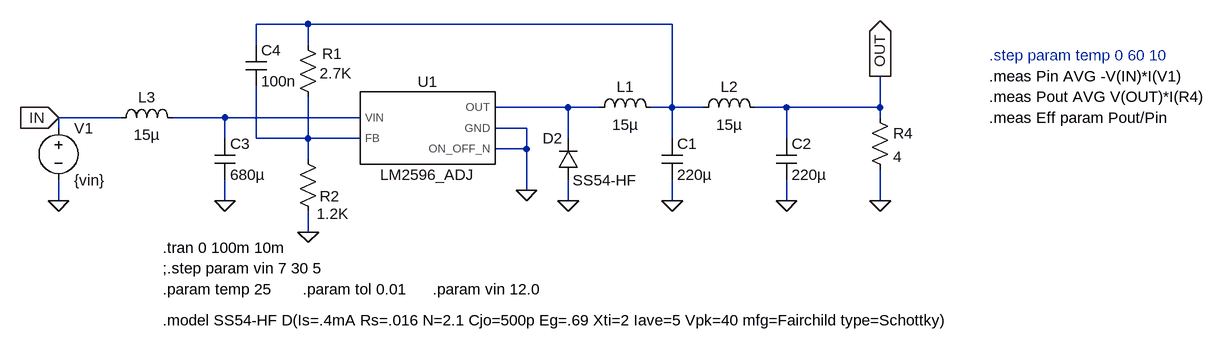
[diagram p0: schematic LM2596 - 4V.asc]
LM2596 - 4V.asc, the LTspice schematic file:
Version 4
SHEET 1 1460 680
WIRE 48 -16 -32 -16
WIRE 608 -16 48 -16
WIRE -32 16 -32 -16
WIRE 48 16 48 -16
WIRE 448 112 336 112
WIRE 496 112 448 112
WIRE 608 112 608 -16
WIRE 608 112 576 112
WIRE 656 112 608 112
WIRE 784 112 736 112
WIRE 928 112 928 64
WIRE 928 112 784 112
WIRE -240 128 -336 128
WIRE -80 128 -160 128
WIRE 128 128 -80 128
WIRE 928 128 928 112
WIRE -336 144 -336 128
WIRE 384 144 336 144
WIRE -80 160 -80 128
WIRE -32 160 -32 80
WIRE 48 160 48 96
WIRE 48 160 -32 160
WIRE 128 160 48 160
WIRE 448 160 448 112
WIRE 608 160 608 112
WIRE 784 160 784 112
WIRE 384 176 384 144
WIRE 384 176 336 176
WIRE 48 192 48 160
WIRE 384 240 384 176
WIRE -336 256 -336 224
WIRE -80 256 -80 224
WIRE 448 256 448 224
WIRE 608 256 608 224
WIRE 784 256 784 224
WIRE 928 256 928 208
WIRE 48 304 48 272
FLAG -336 256 0
FLAG 384 240 0
FLAG 448 256 0
FLAG 608 256 0
FLAG 48 304 0
FLAG 928 256 0
FLAG 928 64 OUT
IOPIN 928 64 Out
FLAG -336 128 IN
IOPIN -336 128 In
FLAG 784 256 0
FLAG -80 256 0
SYMBOL voltage -336 128 R0
WINDOW 123 0 0 Left 0
WINDOW 39 0 0 Left 0
SYMATTR InstName V1
SYMATTR Value {vin}
SYMBOL res 32 0 R0
WINDOW 0 38 30 Left 2
WINDOW 3 34 60 Left 2
SYMATTR InstName R1
SYMATTR Value 2.7K
SYMBOL ind 480 128 R270
WINDOW 0 32 56 VTop 2
WINDOW 3 5 56 VBottom 2
SYMATTR InstName L1
SYMATTR Value 15µ
SYMATTR SpiceLine Rser=0.093
SYMBOL cap 592 160 R0
SYMATTR InstName C1
SYMATTR Value 220µ
SYMBOL res 32 176 R0
WINDOW 0 34 73 Left 2
WINDOW 3 29 100 Left 2
SYMATTR InstName R2
SYMATTR Value 1.2K
SYMBOL res 912 112 R0
SYMATTR InstName R4
SYMATTR Value 4
SYMATTR SpiceLine tol=1
SYMBOL AutoGenerated\\LM2596_ADJ_TRANS 224 144 R0
SYMATTR InstName U1
SYMBOL diode 464 224 R180
WINDOW 0 24 64 Left 2
WINDOW 3 -90 0 Left 2
SYMATTR InstName D2
SYMATTR Value SS54-HF
SYMBOL ind 640 128 R270
WINDOW 0 32 56 VTop 2
WINDOW 3 5 56 VBottom 2
SYMATTR InstName L2
SYMATTR Value 15µ
SYMATTR SpiceLine Rser=0
SYMBOL cap 768 160 R0
SYMATTR InstName C2
SYMATTR Value 220µ
SYMBOL ind -256 144 R270
WINDOW 0 32 56 VTop 2
WINDOW 3 5 56 VBottom 2
SYMATTR InstName L3
SYMATTR Value 15µ
SYMATTR SpiceLine Rser=0.093
SYMBOL cap -96 160 R0
SYMATTR InstName C3
SYMATTR Value 680µ
SYMBOL cap -48 16 R0
SYMATTR InstName C4
SYMATTR Value 100n
TEXT -176 328 Left 2 !.tran 0 100m 10m
TEXT -176 440 Left 2 !.model SS54-HF D(Is=.4mA Rs=.016 N=2.1 Cjo=500p Eg=.69 Xti=2 Iave=5 Vpk=40 mfg=Fairchild type=Schottky)
TEXT -176 360 Left 2 !;.step param vin 7 30 5
TEXT -176 392 Left 2 !.param temp 25
TEXT 1096 32 Left 2 ;.step param temp 0 60 10
TEXT 40 392 Left 2 !.param tol 0.01
TEXT 240 392 Left 2 !.param vin 12.0
TEXT 1096 64 Left 2 !.meas Pin AVG -V(IN)*I(V1)
TEXT 1096 96 Left 2 !.meas Pout AVG V(OUT)*I(R4)
TEXT 1096 128 Left 2 !.meas Eff param Pout/Pin

The netlist it stands for:
* LM2596 - 4V.asc
V1 IN 0 {vin}
R1 N001 N004 2.7K
L1 N002 N001 15µ Rser=0.093
C1 N001 0 220µ
R2 N004 0 1.2K
R4 OUT 0 4 tol=1
XU1 N003 N004 N002 0 0 LM2596_ADJ  ; pins VIN FB OUT GND ON_OFF_N
D2 0 N002 SS54-HF
L2 N001 OUT 15µ Rser=0
C2 OUT 0 220µ
L3 IN N003 15µ Rser=0.093
C3 N003 0 680µ
C4 N001 N004 100n
.model D D
.lib standard.dio
.tran 0 100m 10m
.model SS54-HF D(Is=.4mA Rs=.016 N=2.1 Cjo=500p Eg=.69 Xti=2 Iave=5 Vpk=40 mfg=Fairchild type=Schottky)
;.step param vin 7 30 5
.param temp 25
* .step param temp 0 60 10
.param tol 0.01
.param vin 12.0
.meas Pin AVG -V(IN)*I(V1)
.meas Pout AVG V(OUT)*I(R4)
.meas Eff param Pout/Pin
.lib C:\Users\gabri\Google Drive\ESP32\SIMULATIONS\MODELS\LM2596_ADJ_TRANS.LIB
.backanno
.end